# Altium project VFD.PrjPCB
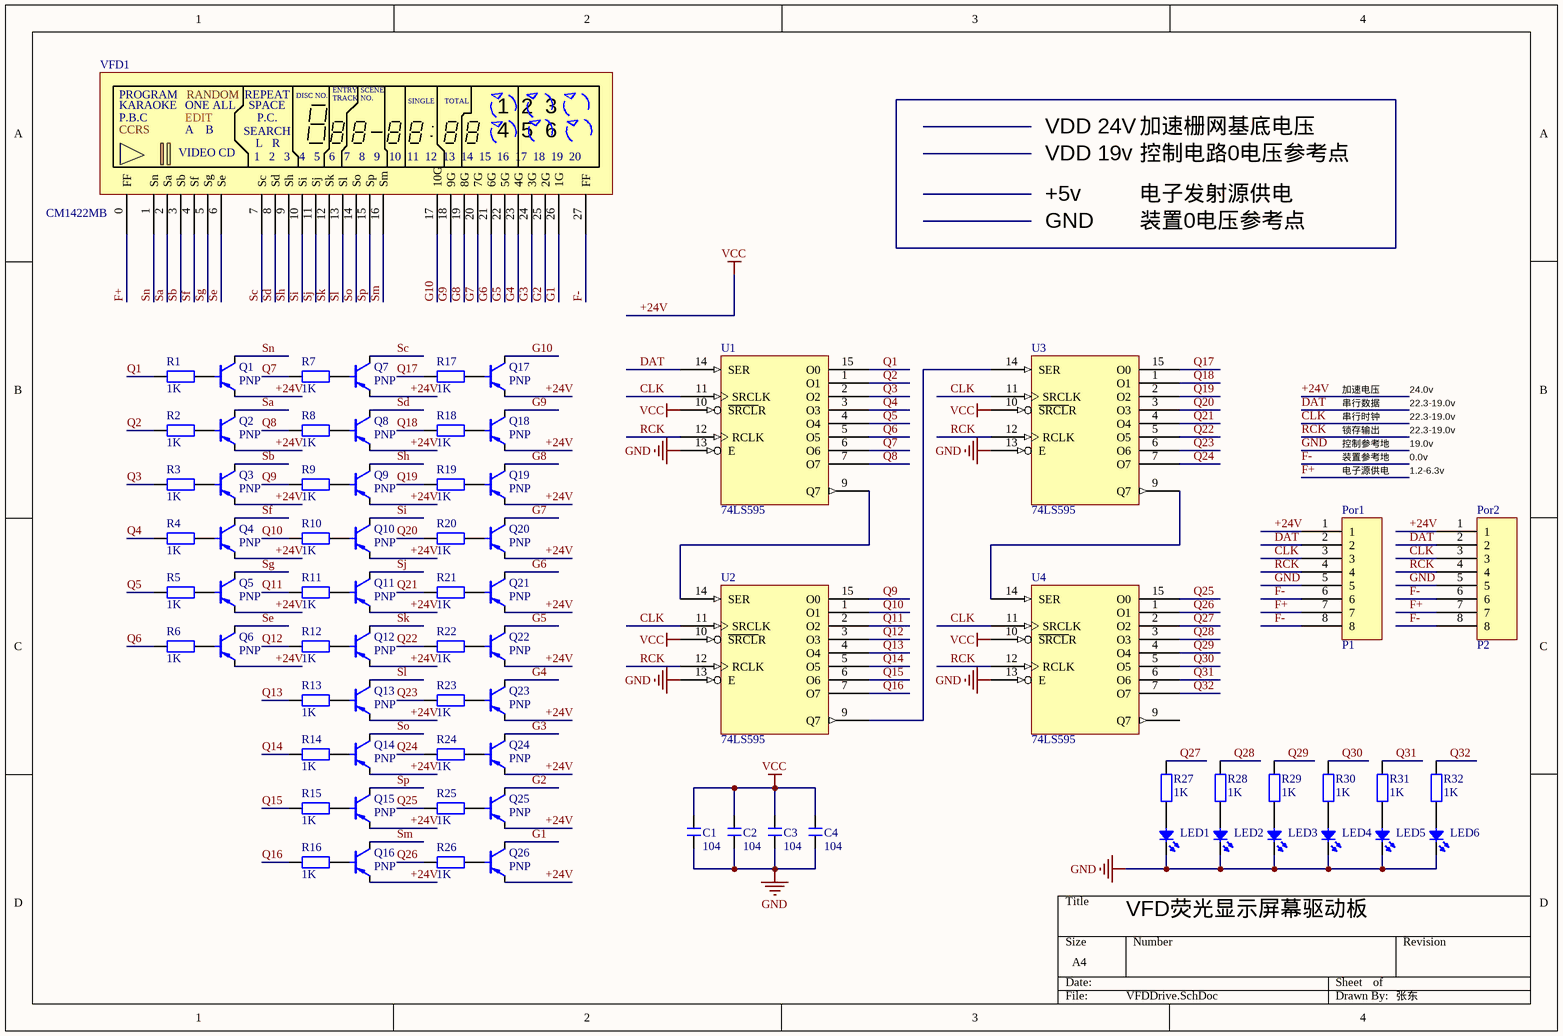
[diagram p0: VFDDrive.SchDoc]
3 sheets, 145 parts. Net scope: global (net labels, ports and power ports of the same name join across sheets).
Board files: VFDDriver.PcbDoc, VFDControl.PcbDoc, kotex.PcbDoc, VFDPower.PcbDoc
Sheets:
  VFDDrive.SchDoc
  VFDControl.SchDoc
  VFDPower.SchDoc

## Sheet VFDDrive.SchDoc
size A4

### Parts
(Parts that share a designator on the sheet are numbered #1, #2 ... from top to bottom, then left to right.)
C1#1  104  [C 0805]
C2#1  104  [C 0805]
C3#1  104  [C 0805]
C4#1  104  [C 0805]
LED1#1  LED  [0805D]  (value not drawn)
LED2#1  LED  [0805D]  (value not drawn)
LED3  LED  [0805D]  (value not drawn)
LED4  LED  [0805D]  (value not drawn)
LED5  LED  [0805D]  (value not drawn)
LED6  LED  [0805D]  (value not drawn)
Por1  P1  [FP8]
Por2  P2  [FP8]
Q1  PNP  [SOT-23]
Q2  PNP  [SOT-23]
Q3  PNP  [SOT-23]
Q4  PNP  [SOT-23]
Q5  PNP  [SOT-23]
Q6  PNP  [SOT-23]
Q7  PNP  [SOT-23]
Q8  PNP  [SOT-23]
Q9  PNP  [SOT-23]
Q10  PNP  [SOT-23]
Q11  PNP  [SOT-23]
Q12  PNP  [SOT-23]
Q13  PNP  [SOT-23]
Q14  PNP  [SOT-23]
Q15  PNP  [SOT-23]
Q16  PNP  [SOT-23]
Q17  PNP  [SOT-23]
Q18  PNP  [SOT-23]
Q19  PNP  [SOT-23]
Q20  PNP  [SOT-23]
Q21  PNP  [SOT-23]
Q22  PNP  [SOT-23]
Q23  PNP  [SOT-23]
Q24  PNP  [SOT-23]
Q25  PNP  [SOT-23]
Q26  PNP  [SOT-23]
R1#1  1K  [R 0805]
R2#1  1K  [R 0805]
R3#1  1K  [R 0805]
R4#1  1K  [R 0805]
R5#1  1K  [R 0805]
R6  1K  [R 0805]
R7#1  1K  [R 0805]
R8#1  1K  [R 0805]
R9#1  1K  [R 0805]
R10#1  1K  [R 0805]
R11#1  1K  [R 0805]
R12#1  1K  [R 0805]
R13  1K  [R 0805]
R14  1K  [R 0805]
R15  1K  [R 0805]
R16  1K  [R 0805]
R17  1K  [R 0805]
R18  1K  [R 0805]
R19  1K  [R 0805]
R20  1K  [R 0805]
R21  1K  [R 0805]
R22  1K  [R 0805]
R23  1K  [R 0805]
R24  1K  [R 0805]
R25  1K  [R 0805]
R26  1K  [R 0805]
R27  1K  [R 0805]
R28  1K  [R 0805]
R29  1K  [R 0805]
R30  1K  [R 0805]
R31  1K  [R 0805]
R32  1K  [R 0805]
U1#1  74LS595  [SOP-16]
U2#1  74LS595  [SOP-16]
U3#1  74LS595  [SOP-16]
U4#1  74LS595  [SOP-16]
VFD1  CM1422MB  [VFD2.5]

### Nets
+24V: C1#1.2 C2#1.2 C3#1.2 C4#1.2 Por1.1 Por2.1 Q1.2(e) Q2.2(e) Q3.2(e) Q4.2(e) Q5.2(e) Q6.2(e) Q7.2(e) Q8.2(e) Q9.2(e) Q10.2(e) Q11.2(e) Q12.2(e) Q13.2(e) Q14.2(e) Q15.2(e) Q16.2(e) Q17.2(e) Q18.2(e) Q19.2(e) Q20.2(e) Q21.2(e) Q22.2(e) Q23.2(e) Q24.2(e) Q25.2(e) Q26.2(e) U1#1.10(~{SRCL}R) U1#1.16(VCC) U2#1.10(~{SRCL}R) U2#1.16(VCC) U3#1.10(~{SRCL}R) U3#1.16(VCC) U4#1.10(~{SRCL}R) U4#1.16(VCC)  [also labelled VCC]
GND: C1#1.1 C2#1.1 C3#1.1 C4#1.1 LED1#1.2(K) LED2#1.2(K) LED3.2(K) LED4.2(K) LED5.2(K) LED6.2(K) Por1.5 Por2.5 U1#1.8(GND) U1#1.13(E) U2#1.8(GND) U2#1.13(E) U3#1.8(GND) U3#1.13(E) U4#1.8(GND) U4#1.13(E)
CLK: Por1.3 Por2.3 U1#1.11(SRCLK) U2#1.11(SRCLK) U3#1.11(SRCLK) U4#1.11(SRCLK)
DAT: Por1.2 Por2.2 U1#1.14(SER)
F+: Por1.7 Por2.7 VFD1.0(FF)
F-: Por1.6 Por1.8 Por2.6 Por2.8 VFD1.27(FF)
G1: Q26.1(c) VFD1.26(1G)
G2: Q25.1(c) VFD1.25(2G)
G3: Q24.1(c) VFD1.24(3G)
G4: Q23.1(c) VFD1.23(4G)
G5: Q22.1(c) VFD1.22(5G)
G6: Q21.1(c) VFD1.21(6G)
G7: Q20.1(c) VFD1.20(7G)
G8: Q19.1(c) VFD1.19(8G)
G9: Q18.1(c) VFD1.18(9G)
G10: Q17.1(c) VFD1.17(10G)
Q1: R1#1.1 U1#1.15(O0)
Q2: R2#1.1 U1#1.1(O1)
Q3: R3#1.2 U1#1.2(O2)
Q4: R4#1.2 U1#1.3(O3)
Q5: R5#1.2 U1#1.4(O4)
Q6: R6.2 U1#1.5(O5)
Q7: R7#1.2 U1#1.6(O6)
Q8: R8#1.2 U1#1.7(O7)
Q9: R9#1.2 U2#1.15(O0)
Q10: R10#1.2 U2#1.1(O1)
Q11: R11#1.2 U2#1.2(O2)
Q12: R12#1.2 U2#1.3(O3)
Q13: R13.2 U2#1.4(O4)
Q14: R14.2 U2#1.5(O5)
Q15: R15.2 U2#1.6(O6)
Q16: R16.2 U2#1.7(O7)
Q17: R17.2 U3#1.15(O0)
Q18: R18.2 U3#1.1(O1)
Q19: R19.2 U3#1.2(O2)
Q20: R20.2 U3#1.3(O3)
Q21: R21.2 U3#1.4(O4)
Q22: R22.2 U3#1.5(O5)
Q23: R23.2 U3#1.6(O6)
Q24: R24.2 U3#1.7(O7)
Q25: R25.2 U4#1.15(O0)
Q26: R26.2 U4#1.1(O1)
Q27: R27.2 U4#1.2(O2)
Q28: R28.2 U4#1.3(O3)
Q29: R29.2 U4#1.4(O4)
Q30: R30.2 U4#1.5(O5)
Q31: R31.2 U4#1.6(O6)
Q32: R32.2 U4#1.7(O7)
RCK: Por1.4 Por2.4 U1#1.12(RCLK) U2#1.12(RCLK) U3#1.12(RCLK) U4#1.12(RCLK)
Sa: Q2.1(c) VFD1.2(Sa)
Sb: Q3.1(c) VFD1.3(Sb)
Sc: Q7.1(c) VFD1.7(Sc)
Sd: Q8.1(c) VFD1.8(Sd)
Se: Q6.1(c) VFD1.6(Se)
Sf: Q4.1(c) VFD1.4(Sf)
Sg: Q5.1(c) VFD1.5(Sg)
Sh: Q9.1(c) VFD1.9(Sh)
Si: Q10.1(c) VFD1.10(Si)
Sj: Q11.1(c) VFD1.11(Sj)
Sk: Q12.1(c) VFD1.12(Sk)
Sl: Q13.1(c) VFD1.13(Sl)
Sm: Q16.1(c) VFD1.16(Sm)
Sn: Q1.1(c) VFD1.1(Sn)
So: Q14.1(c) VFD1.14(So)
Sp: Q15.1(c) VFD1.15(Sp)
NetLED1#1_1: LED1#1.1(A) R27.1
NetLED2#1_1: LED2#1.1(A) R28.1
NetLED3_1: LED3.1(A) R29.1
NetLED4_1: LED4.1(A) R30.1
NetLED5_1: LED5.1(A) R31.1
NetLED6_1: LED6.1(A) R32.1
NetQ1_3: Q1.3(b) R1#1.2
NetQ2_3: Q2.3(b) R2#1.2
NetQ3_3: Q3.3(b) R3#1.1
NetQ4_3: Q4.3(b) R4#1.1
NetQ5_3: Q5.3(b) R5#1.1
NetQ6_3: Q6.3(b) R6.1
NetQ7_3: Q7.3(b) R7#1.1
NetQ8_3: Q8.3(b) R8#1.1
NetQ9_3: Q9.3(b) R9#1.1
NetQ10_3: Q10.3(b) R10#1.1
NetQ11_3: Q11.3(b) R11#1.1
NetQ12_3: Q12.3(b) R12#1.1
NetQ13_3: Q13.3(b) R13.1
NetQ14_3: Q14.3(b) R14.1
NetQ15_3: Q15.3(b) R15.1
NetQ16_3: Q16.3(b) R16.1
NetQ17_3: Q17.3(b) R17.1
NetQ18_3: Q18.3(b) R18.1
NetQ19_3: Q19.3(b) R19.1
NetQ20_3: Q20.3(b) R20.1
NetQ21_3: Q21.3(b) R21.1
NetQ22_3: Q22.3(b) R22.1
NetQ23_3: Q23.3(b) R23.1
NetQ24_3: Q24.3(b) R24.1
NetQ25_3: Q25.3(b) R25.1
NetQ26_3: Q26.3(b) R26.1
NetU1#1_9: U1#1.9(Q7) U2#1.14(SER)
NetU2#1_9: U2#1.9(Q7) U3#1.14(SER)
NetU3#1_9: U3#1.9(Q7) U4#1.14(SER)

Not connected (* = marked no-connect by the designer): U4#1 9(Q7)

### Notes on the sheet
- VDD 19v
- VDD 24V
- 控制电路0电压参考点
- 加速栅网基底电压
- GND
- +5v
- 电子发射源供电
- 装置0电压参考点
- 加速电压
- 串行数据
- 串行时钟
- 锁存输出
- 控制参考地
- 24.0v
- 22.3-19.0v
- 19.0v
- 装置参考地
- 电子源供电
- 0.0v
- 1.2-6.3v
- VFD荧光显示屏幕驱动板
- 张东
- (in symbol CM1422MB) ENTRY; SCENE; PROGRAM; RANDOM; REPEAT; DISC NO.; TRACK; NO.; SINGLE; TOTAL; KARAOKE; ONE ALL; SPACE; 1  2  3; P.B.C; EDIT; P.C.; CCRS; A    B; SEARCH; 4  5  6; L   R; VIDEO CD; 1   2   3   4   5   6   7   8   9   10  11  12  13  14  15  16  17  18  19  20

### Library data of the parts
C1#1 C2#1 C3#1 C4#1 = C: 无极性贴片电容; 版权归属: 源创客; BOM名称: 无极性贴片电容; 学习资源: www.ooocke.com
Por1 Por2 = Header
R1#1 R2#1 R3#1 R4#1 R5#1 R6 R7#1 R8#1 R9#1 R10#1 R11#1 R12#1 R13-R32 = R: 贴片电阻; 版权归属: 源创客; BOM名称: 贴片电阻; 学习资源: www.ooocke.com
LED1#1 LED2#1 LED3-LED6 = LED: Published: 8-Jun-2000; LatestRevisionDate: 08-Jul-2005; LatestRevisionNote: Mech Layer 1 removed.; PackageReference: LED-0; Publisher: Altium Limited; PackageDescription: LED; 2 Leads

## Sheet VFDControl.SchDoc
size A4
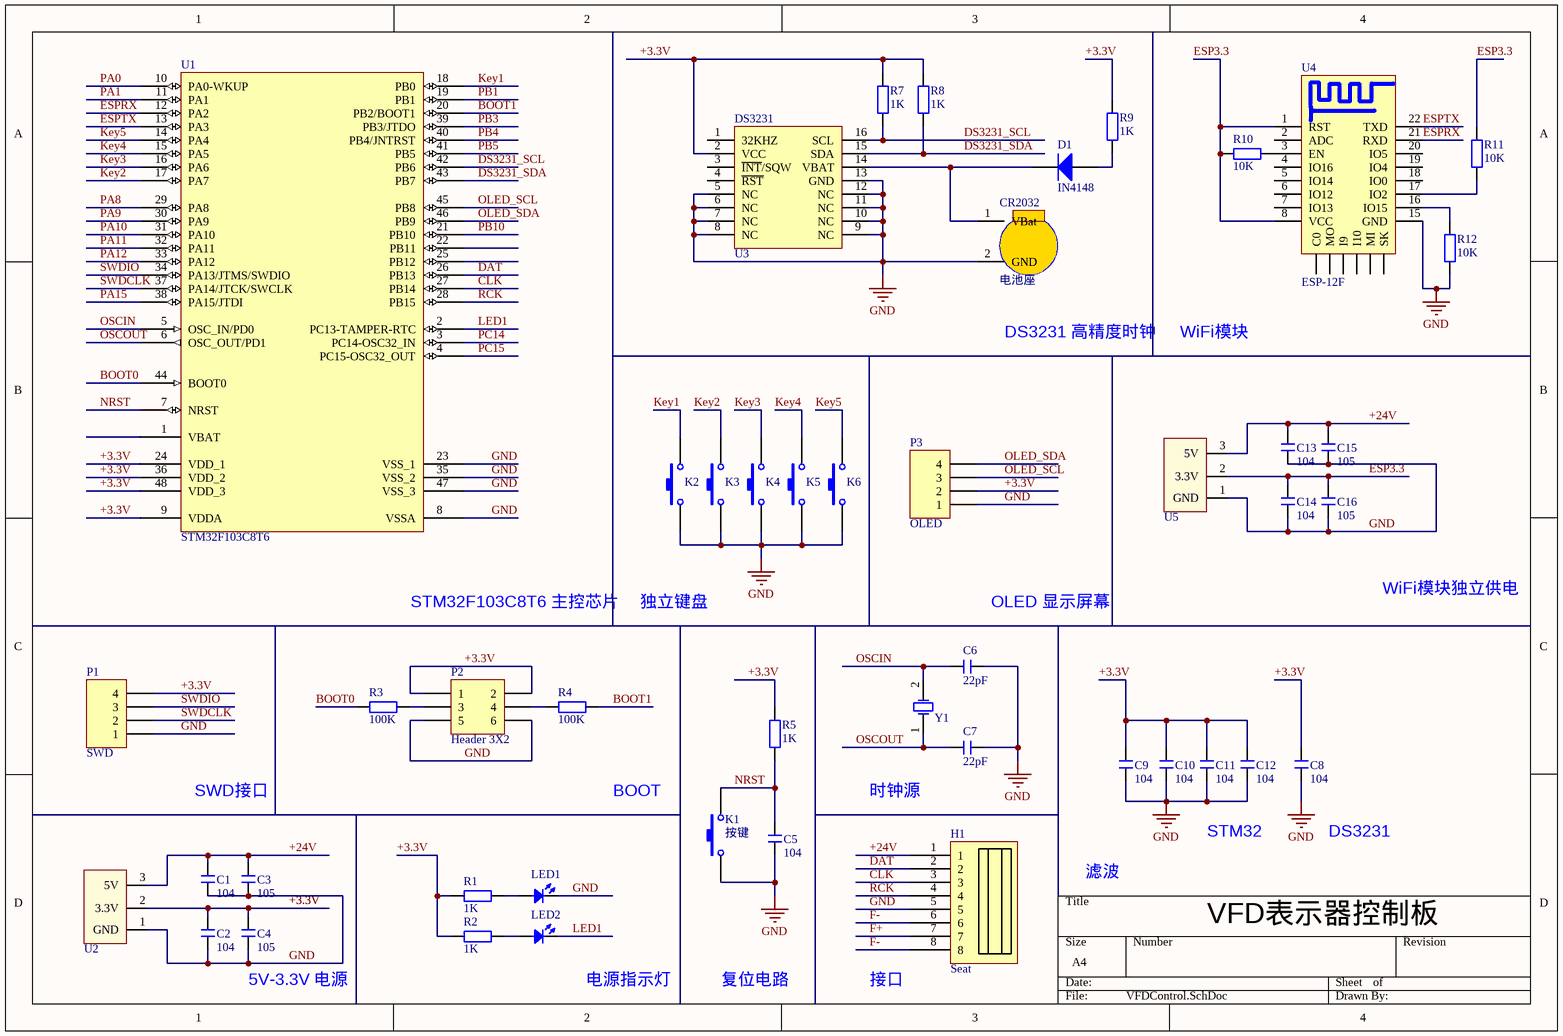
[diagram p1: VFDControl.SchDoc]

### Parts
(Parts that share a designator on the sheet are numbered #1, #2 ... from top to bottom, then left to right.)
C1#2  104  [C 0805]
C2#2  104  [C 0805]
C3#2  105  [C 0805]
C4#2  105  [C 0805]
C5#1  104  [C 0805]
C6#1  22pF  [C 0805]
C7#1  22pF  [C 0805]
C8#1  104  [C 0805]
C9#1  104  [C 0805]
C10#1  104  [C 0805]
C11#1  104  [C 0805]
C12#1  104  [C 0805]
C13  104  [C 0805]
C14  104  [C 0805]
C15  105  [C 0805]
C16  105  [C 0805]
CR2032  电池座  [CR2032 电池座]
D1#1  IN4148  [0805D]
H1#1  Seat  [SEAT8]
K1  按键  [按键]
K2  按键  [按键]  (value not drawn)
K3  按键  [按键]  (value not drawn)
K4  按键  [按键]  (value not drawn)
K5  按键  [按键]  (value not drawn)
K6  按键  [按键]  (value not drawn)
LED1#2  LED  [0805D]  (value not drawn)
LED2#2  LED  [0805D]  (value not drawn)
P1#1  SWD  [HDR1X4]
P2  Header 3X2  [HDR2X3]
P3  OLED  [HDR1X4]
R1#2  1K  [R 0805]
R2#2  1K  [R 0805]
R3#2  100K  [R 0805]
R4#2  100K  [R 0805]
R5#2  1K  [R 0805]
R7#2  1K  [R 0805]
R8#2  1K  [R 0805]
R9#2  1K  [R 0805]
R10#2  10K  [R 0805]
R11#2  10K  [R 0805]
R12#2  10K  [R 0805]
U1#2  STM32F103C8T6  [LQFP48 7X7_M]
U2#2  LM1117  [SOT-223]  (value not drawn)
U3#2  DS3231  [SOL-16]
U4#2  ESP-12F  [ESP-12F]
U5  LM1117  [SOT-223]  (value not drawn)
Y1  XTAL  [XTAL1]  (value not drawn)

### Nets
+24V: C1#2.2 C3#2.1 C13.2 C15.1 H1#1.1 U2#2.3(5V) U5.3(5V)
GND: C1#2.1 C2#2.1 C3#2.2 C4#2.2 C5#1.1 C6#1.2 C7#1.2 C8#1.1 C9#1.2 C10#1.2 C11#1.2 C12#1.2 C13.1 C14.1 C15.2 C16.2 CR2032.2(GND) H1#1.5 K1.1 K2.1 K3.1 K4.1 K5.1 K6.1 LED1#2.2(K) P1#1.1 P2.5 P2.6 P3.1 R12#2.1 U1#2.8(VSSA) U1#2.23(VSS_1) U1#2.35(VSS_2) U1#2.47(VSS_3) U2#2.1(GND) U3#2.5(NC) U3#2.6(NC) U3#2.7(NC) U3#2.8(NC) U3#2.9(NC) U3#2.10(NC) U3#2.11(NC) U3#2.12(NC) U3#2.13(GND) U4#2.15(SK) U5.1(GND)
+3.3V: C2#2.2 C4#2.1 C8#1.2 C9#1.1 C10#1.1 C11#1.1 C12#1.1 P1#1.4 P2.1 P2.2 P3.2 R1#2.1 R2#2.1 R5#2.2 R7#2.2 R8#2.2 R9#2.1 U1#2.9(VDDA) U1#2.24(VDD_1) U1#2.36(VDD_2) U1#2.48(VDD_3) U2#2.2(3.3V) U3#2.2(VCC)
BOOT0: R3#2.1 U1#2.44(BOOT0)
BOOT1: R4#2.2 U1#2.20(PB2/BOOT1)
CLK: H1#1.3 U1#2.27(PB14)
DAT: H1#1.2 U1#2.26(PB13)
DS3231_SCL: R7#2.1 U1#2.42(PB6) U3#2.16(SCL)
DS3231_SDA: R8#2.1 U1#2.43(PB7) U3#2.15(SDA)
ESP3.3: C14.2 C16.1 R10#2.1 R11#2.2 U4#2.1(RST) U4#2.8(VCC) U5.2(3.3V)
ESPRX: U1#2.12(PA2) U4#2.21(RXD)
ESPTX: U1#2.13(PA3) U4#2.22(TXD)
F+: H1#1.7
F-: H1#1.6 H1#1.8
Key1: K2.2 U1#2.18(PB0)
Key2: K3.2 U1#2.17(PA7)
Key3: K4.2 U1#2.16(PA6)
Key4: K5.2 U1#2.15(PA5)
Key5: K6.2 U1#2.14(PA4)
LED1: LED2#2.2(K) U1#2.2(PC13-TAMPER-RTC)
NRST: C5#1.2 K1.2 R5#2.1 U1#2.7(NRST)
OLED_SCL: P3.3 U1#2.45(PB8)
OLED_SDA: P3.4 U1#2.46(PB9)
OSCIN: C6#1.1 U1#2.5(OSC_IN/PD0) Y1.2(OSC2)
OSCOUT: C7#1.1 U1#2.6(OSC_OUT/PD1) Y1.1(OSC1)
PA0: U1#2.10(PA0-WKUP)
PA1: U1#2.11(PA1)
PA8: U1#2.29(PA8)
PA9: U1#2.30(PA9)
PA10: U1#2.31(PA10)
PA11: U1#2.32(PA11)
PA12: U1#2.33(PA12)
PA15: U1#2.38(PA15/JTDI)
PB1: U1#2.19(PB1)
PB3: U1#2.39(PB3/JTDO)
PB4: U1#2.40(PB4/JNTRST)
PB5: U1#2.41(PB5)
PB10: U1#2.21(PB10)
PC14: U1#2.3(PC14-OSC32_IN)
PC15: U1#2.4(PC15-OSC32_OUT)
RCK: H1#1.4 U1#2.28(PB15)
SWDCLK: P1#1.2 U1#2.37(PA14/JTCK/SWCLK)
SWDIO: P1#1.3 U1#2.34(PA13/JTMS/SWDIO)
NetCR2032_1: CR2032.1(VBat) D1#1.2(K) U3#2.14(VBAT)
NetD1#1_1: D1#1.1(A) R9#2.2
NetLED1#2_1: LED1#2.1(A) R1#2.2
NetLED2#2_1: LED2#2.1(A) R2#2.2
NetP2_3: P2.3 R3#2.2
NetP2_4: P2.4 R4#2.1
NetR10#2_2: R10#2.2 U4#2.3(EN)
NetR11#2_1: R11#2.1 U4#2.17(IO2)
NetR12#2_2: R12#2.2 U4#2.16(IO15)

Not connected (* = marked no-connect by the designer): U1#2 1(VBAT) 22(PB11) 25(PB12); U3#2 1(32KHZ) 3(~{INT}/SQW) 4(~{RST}); U4#2 2(ADC) 4(IO16) 5(IO14) 6(IO12) 7(IO13) 9(C0) 10(MO) 11(I9) 12(I10) 13(MI) 18(IO0) 19(IO4) 20(IO5)

### Notes on the sheet
- DS3231 高精度时钟
- WiFi模块
- STM32F103C8T6 主控芯片
- 独立键盘
- OLED 显示屏幕
- WiFi模块独立供电
- SWD接口
- BOOT
- 时钟源
- STM32
- DS3231
- 滤波
- 5V-3.3V 电源
- (near LED2#2) 电源指示灯
- 复位电路
- 接口
- VFD表示器控制板

### Library data of the parts
C1#2 C2#2 C3#2 C4#2 C5#1 C6#1 C7#1 C8#1 C9#1 C10#1 C11#1 C12#1 C13-C16 = C: 无极性贴片电容; 版权归属: 源创客; BOM名称: 无极性贴片电容; 学习资源: www.ooocke.com
CR2032 = CR2032 电池座
D1#1 = 二级管
P1#1 P3 = Header 4: Header, 4-Pin; LatestRevisionDate: 17-Jul-2002; LatestRevisionNote: Re-released for DXP Platform.; Publisher: Altium Limited
P2 = Header 3X2: Header, 3-Pin, Dual row; LatestRevisionDate: 17-Jul-2002; LatestRevisionNote: Re-released for DXP Platform.; Publisher: Altium Limited
R1#2 R2#2 R3#2 R4#2 R5#2 R7#2 R8#2 R9#2 R10#2 R11#2 R12#2 = R: 贴片电阻; 版权归属: 源创客; BOM名称: 贴片电阻; 学习资源: www.ooocke.com
U1#2 = STM32F103C8T6: Flaah:64/RAM:20/IO:36; BOM名称: 32位STM单片机; 版权归属: 源创客; 学习资源: www.ooocke.com
LED1#2 LED2#2 = LED: Published: 8-Jun-2000; LatestRevisionDate: 08-Jul-2005; LatestRevisionNote: Mech Layer 1 removed.; PackageReference: LED-0; Publisher: Altium Limited; PackageDescription: LED; 2 Leads
Y1 = XTAL: Published: 8-Jun-2000; LatestRevisionDate: 17-Jul-2002; LatestRevisionNote: Re-released for DXP Platform.; PackageReference: R38; Publisher: Altium Limited; PackageDescription: Crystal, Thru-Hole; 2 Leads; Body 3.1 x 8.2 mm (Dia.xH)

## Sheet VFDPower.SchDoc
size A4
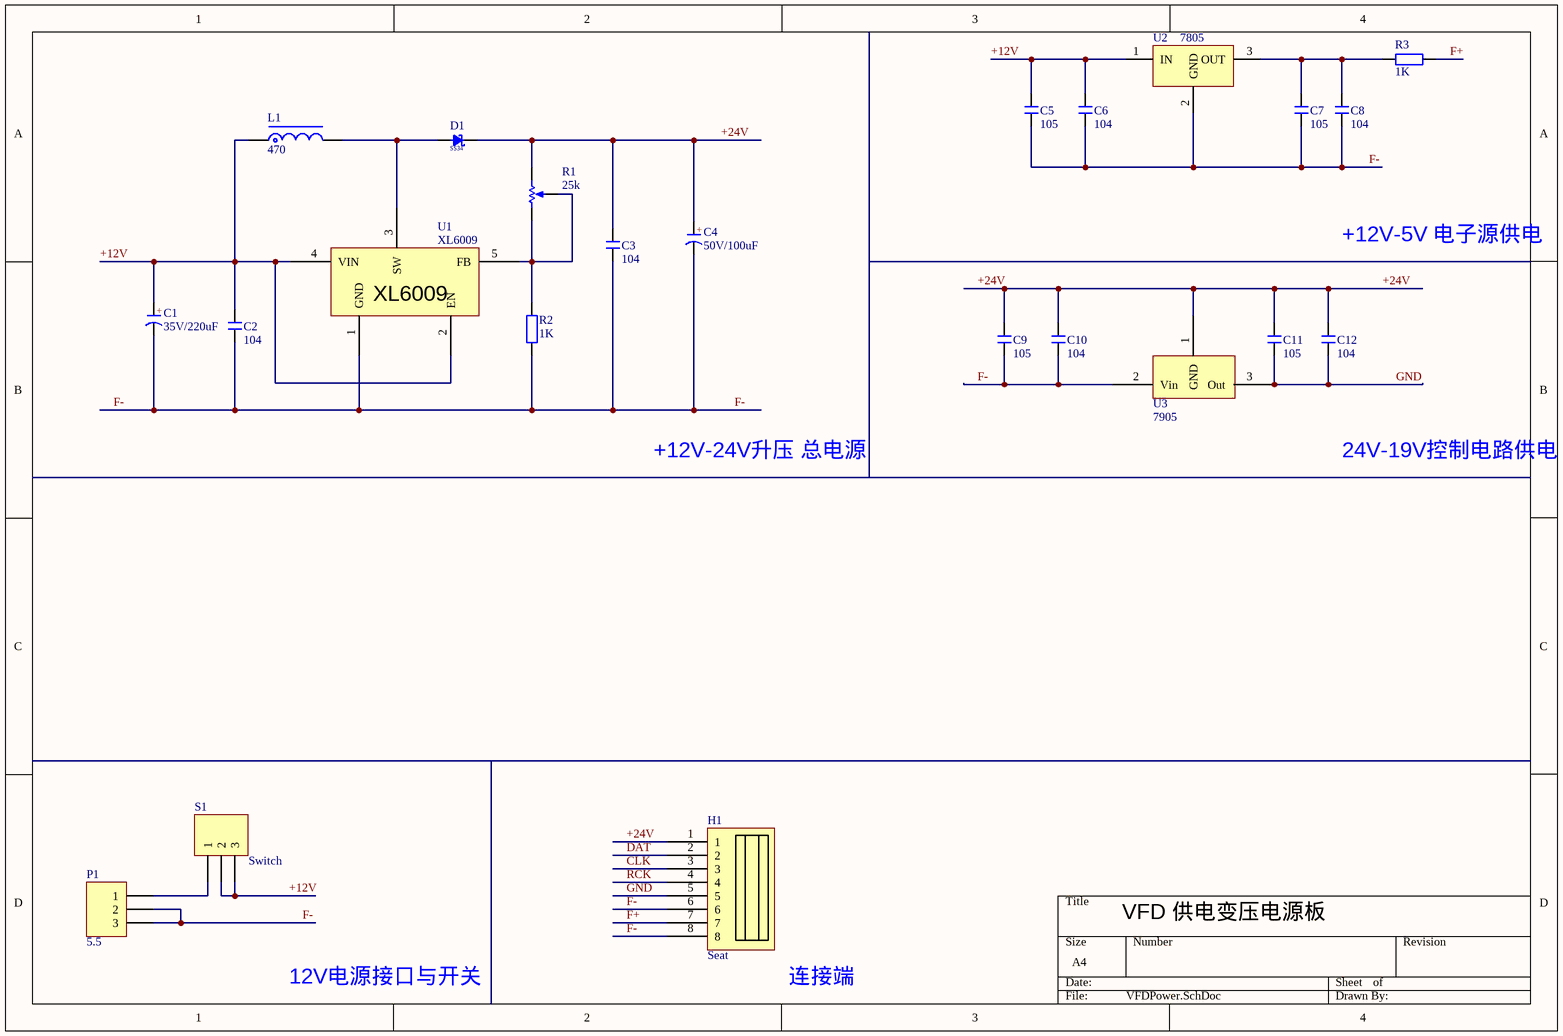
[diagram p2: VFDPower.SchDoc]

### Parts
(Parts that share a designator on the sheet are numbered #1, #2 ... from top to bottom, then left to right.)
C1#3  35V/220uF  [CM D(6.3*5.4)]
C2#3  104  [C 0805]
C3#3  104  [C 0805]
C4#3  50V/100uF  [CM D(6.3*5.4)]
C5#2  105  [C 0805]
C6#2  104  [C 0805]
C7#2  105  [C 0805]
C8#2  104  [C 0805]
C9#2  105  [C 0805]
C10#2  104  [C 0805]
C11#2  105  [C 0805]
C12#2  104  [C 0805]
D1#2  value SS34  [DO-214-M7-  4007贴片]  (hidden comment: D 肖特基)
H1#2  Seat  [SEAT8]
L1  470  [CDRH127]
P1#2  5.5  [DC-5.5*2.1]
R1#3  value 25k  [VR5]  (hidden comment: RPot)
R2#3  1K  [R 0805]
R3#3  1K  [R 0805]
S1  Switch  [HDR1X3]
U1#3  XL6009  [TO-263(T)]
U2#3  7805  [TO-263]
U3#3  7905  [TO-263]

### Nets
+24V: C3#3.2 C4#3.1(A) C9#2.2 C10#2.2 C11#2.2 C12#2.2 D1#2.2(K) H1#2.1 R1#3.1(BOT) U3#3.1(GND)
GND: C11#2.1 C12#2.1 H1#2.5 U3#3.3(Out)
+12V: C1#3.1(A) C2#3.2 C5#2.2 C6#2.2 L1.1 S1.2 S1.3 U1#3.2(EN) U1#3.4(VIN) U2#3.1(IN)
CLK: H1#2.3
DAT: H1#2.2
F+: H1#2.7 R3#3.2
F-: C1#3.2(K) C2#3.1 C3#3.1 C4#3.2(K) C5#2.1 C6#2.1 C7#2.1 C8#2.2 C9#2.1 C10#2.1 H1#2.6 H1#2.8 P1#2.2 P1#2.3 R2#3.1 U1#3.1(GND) U2#3.2(GND) U3#3.2(Vin)
RCK: H1#2.4
NetC7#2_2: C7#2.2 C8#2.1 R3#3.1 U2#3.3(OUT)
NetD1#2_1: D1#2.1(A) L1.2 U1#3.3(SW)
NetP1#2_1: P1#2.1 S1.1
NetR1#3_2: R1#3.2(TAP) R1#3.3(TOP) R2#3.2 U1#3.5(FB)

### Notes on the sheet
- +12V-5V 电子源供电
- +12V-24V升压 总电源
- 24V-19V控制电路供电
- VFD 供电变压电源板
- 12V电源接口与开关
- 连接端
- (in symbol C-CM) +

### Library data of the parts
C1#3 C4#3 = C-CM: 贴片电解电容; 版权归属: 源创客; BOM名称: 贴片电解电容; 学习资源: www.ooocke.com
C2#3 C3#3 C5#2 C6#2 C7#2 C8#2 C9#2 C10#2 C11#2 C12#2 = C: 无极性贴片电容; 版权归属: 源创客; BOM名称: 无极性贴片电容; 学习资源: www.ooocke.com
L1 = L-CDRH: 功率屏蔽电感; 版权归属: 源创客; BOM名称: 功率屏蔽电感; 学习资源: www.ooocke.com
P1#2 S1 = Header 3: Header, 3-Pin; LatestRevisionDate: 17-Jul-2002; LatestRevisionNote: Re-released for DXP Platform.; Publisher: Altium Limited
R1#3 = RPot: Potentiometer; Sim Note: Enter the Resistance value and the set point into parameter fields.; Set Position: 0.5; Published: 8-Jun-2000; LatestRevisionDate: 17-Jul-2002; LatestRevisionNote: Re-released for DXP Platform.; PackageReference: VR5; Publisher: Altium Limited; PackageDescription: Variable Resistor, Thru-Hole; 3 Leads
R2#3 R3#3 = R: 贴片电阻; 版权归属: 源创客; BOM名称: 贴片电阻; 学习资源: www.ooocke.com
U2#3 = 78XX
U3#3 = 79**
D1#2 = D 肖特基: Published: 8-Jun-2000; LatestRevisionDate: 17-Jul-2002; LatestRevisionNote: Re-released for DXP Platform.; PackageReference: SMB; Publisher: Altium Limited; PackageDescription: DO-214-AA/SMB; 2 C-Bend Leads; Body 5.3 x 3.6 mm, inc. leads (LxW); Code_JEDEC: DO-214-AA

## Nets that join several sheets
+24V: VFDDrive (40 pins), VFDControl (7 pins), VFDPower (10 pins)
GND: VFDDrive (20 pins), VFDControl (46 pins), VFDPower (C11#2.1 C12#2.1 H1#2.5 U3#3.3)
CLK: VFDDrive (6 pins), VFDControl (H1#1.3 U1#2.27), VFDPower (H1#2.3)
DAT: VFDDrive (Por1.2 Por2.2 U1#1.14), VFDControl (H1#1.2 U1#2.26), VFDPower (H1#2.2)
F+: VFDDrive (Por1.7 Por2.7 VFD1.0), VFDControl (H1#1.7), VFDPower (H1#2.7 R3#3.2)
F-: VFDDrive (5 pins), VFDControl (H1#1.6 H1#1.8), VFDPower (18 pins)
RCK: VFDDrive (6 pins), VFDControl (H1#1.4 U1#2.28), VFDPower (H1#2.4)